# Altium project Slave_2_buttons.PrjPcb
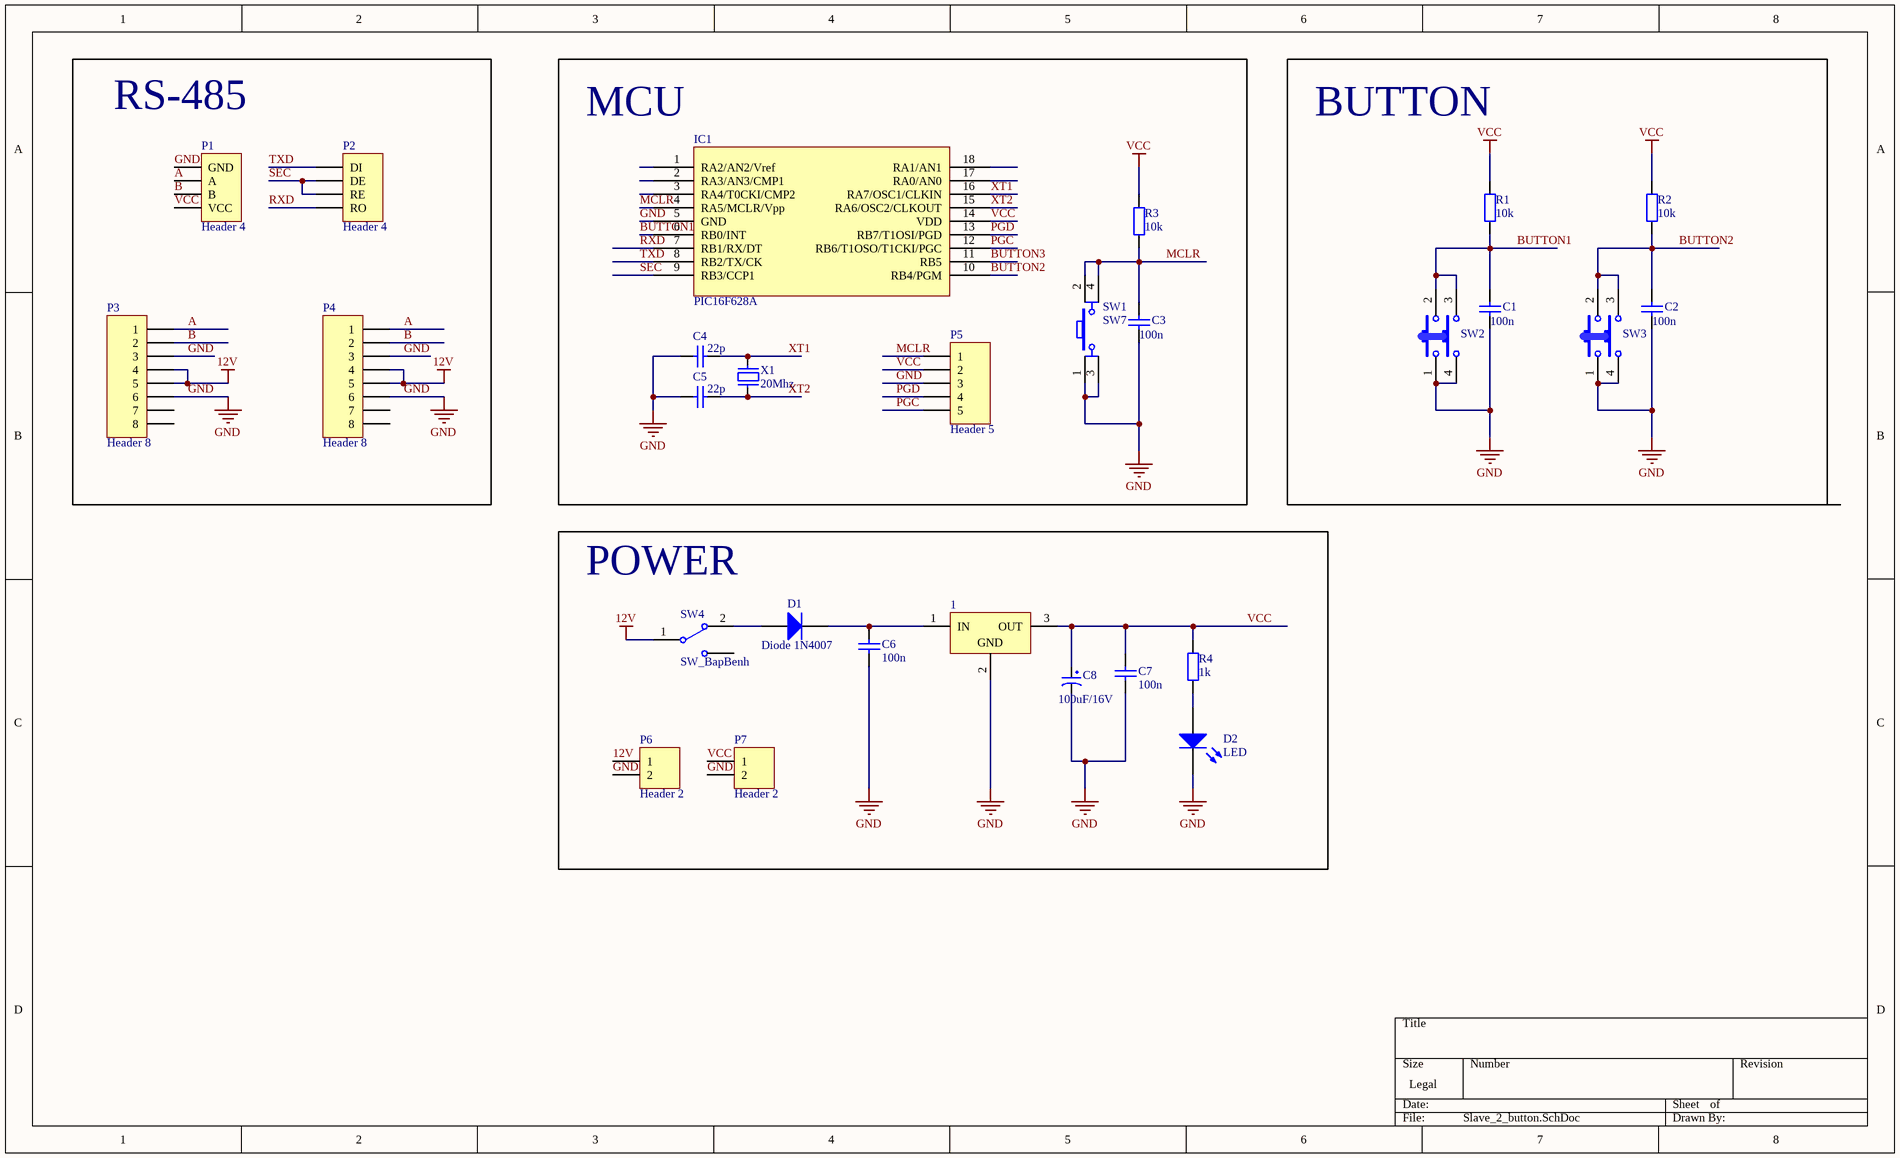
[diagram p0: Slave_2_button.SchDoc]
1 sheet, 28 parts. Net scope: global (net labels, ports and power ports of the same name join across sheets).
Board file: Slave_2_button.PcbDoc

## Sheet Slave_2_button.SchDoc
size Legal

### Parts
1  L78M05CP  [QTO-220]  (value not drawn)
C1  value 100n  [Cap Non-Pol 3mm]  (hidden comment: Capacitor Ceramic)
C2  value 100n  [Cap Non-Pol 3mm]  (hidden comment: Capacitor Ceramic)
C3  value 100n  [Cap Non-Pol 3mm]  (hidden comment: Capacitor Ceramic)
C4  value 22p  [Cap Non-Pol 3mm]  (hidden comment: Cap Non-pol)
C5  value 22p  [Cap Non-Pol 3mm]  (hidden comment: Cap Non-pol)
C6  value 100n  [Cap Non-Pol 3mm]  (hidden comment: Cap Non-pol)
C7  value 100n  [Cap Non-Pol 3mm]  (hidden comment: Cap Non-pol)
C8  100uF/16V  [CP1.5/3.4]
D1  Diode 1N4007  [DO-41]
D2  LED  [LED-5mm RED]
IC1  PIC16F628A  [DIP18/W0.3]
P1  Header 4  [HDR1X4]
P2  Header 4  [HDR1X4]
P3  Header 8  [RJ11]
P4  Header 8  [RJ11]
P5  Header 5  [Header 5]
P6  Header 2  [HDR1X2]
P7  Header 2  [HDR1X2]
R1  value 10k  [RESISTOR 1/4W]  (hidden comment: RES_SMD_0805)
R2  value 10k  [RESISTOR 1/4W]  (hidden comment: RES_SMD_0805)
R3  value 10k  [RESISTOR 1/4W]  (hidden comment: RES_SMD_0805)
R4  value 1k  [RESISTOR 1/4W]  (hidden comment: RES_SMD_0805)
SW1  SW7  [SW4]
SW2  SW-4P-B  [SW-4P-B]  (value not drawn)
SW3  SW-4P-B  [SW-4P-B]  (value not drawn)
SW4  SW_BapBenh  [SW_Bapbenh]
X1  20Mhz  [XT2]

### Blocks framed on the sheet
RS-485: P1-P4
MCU: C3-C5 IC1 P5 R3 SW1 X1
POWER: 1 C6-C8 D1 D2 P6 P7 R4 SW4

### Nets
12V: P3.4 P3.5 P4.4 P4.5 P6.1 SW4.1
GND: 1.2(GND) C1.1 C2.1 C3.1 C4.2 C5.2 C6.1 C7.1 C8.2 D2.2(K) IC1.5(GND) P1.1(GND) P3.3 P3.6 P4.3 P4.6 P5.3 P6.2 P7.2 SW1.1 SW1.3 SW2.1 SW2.4 SW3.1 SW3.4
VCC: 1.3(OUT) C7.2 C8.1 IC1.14(VDD) P1.4(VCC) P5.2 P7.1 R1.2 R2.2 R3.2 R4.2
A: P1.2(A) P3.1 P4.1
B: P1.3(B) P3.2 P4.2
BUTTON1: C1.2 IC1.6(RB0/INT) R1.1 SW2.2 SW2.3
BUTTON2: C2.2 IC1.10(RB4/PGM) R2.1 SW3.2 SW3.3
BUTTON3: IC1.11(RB5)
MCLR: C3.2 IC1.4(RA5/MCLR/Vpp) P5.1 R3.1 SW1.2 SW1.4
PGC: IC1.12(RB6/T1OSO/T1CKI/PGC) P5.5
PGD: IC1.13(RB7/T1OSI/PGD) P5.4
RXD: IC1.7(RB1/RX/DT) P2.4(RO)
SEC: IC1.9(RB3/CCP1) P2.2(DE) P2.3(RE)
TXD: IC1.8(RB2/TX/CK) P2.1(DI)
XT1: C4.1 IC1.16(RA7/OSC1/CLKIN) X1.2
XT2: C5.1 IC1.15(RA6/OSC2/CLKOUT) X1.1
Net1_1: 1.1(IN) C6.2 D1.2(K)
NetD1_1: D1.1(A) SW4.2
NetD2_1: D2.1(A) R4.1

Not connected (* = marked no-connect by the designer): IC1 1(RA2/AN2/Vref) 2(RA3/AN3/CMP1) 3(RA4/T0CKI/CMP2) 17(RA0/AN0) 18(RA1/AN1); P3 7 8; P4 7 8

### Notes on the sheet
- BUTTON

### Library data of the parts
1 = L78M05CP: Positive Voltage Regulator; Note: Tab is connected to pin 3 (GND).; Published: 24-Aug-2001; LatestRevisionDate: 17-Jul-2002; LatestRevisionNote: Re-released for DXP Platform.; DatasheetVersion: Apr-1994; PackageVersion: Jul-1998; PackageReference: ISOWATT220AB; Publisher: Altium Limited; PackageDescription: TO, Thru-Hole, Vertical, Heatsink Mounted; 3 In-Line Leads; Pitch 2.54 mm; Pin sequence 1, 3, 2; ComponentLink1Description: Manufacturer Link; ComponentLink1URL: http://www.st.com/; ComponentLink2Description: Datasheet; ComponentLink2URL: http://www.st.com/stonline/products/literature/ds/2146/l78m05c.pdf
C1-C3 = CapSMD: Capacitor; Published: 8-Jun-2000; LatestRevisionDate: 17-Jul-2002; LatestRevisionNote: Re-released for DXP Platform.; PackageReference: RAD-0.3; Publisher: Altium Limited
C4-C7 = Cap Non-pol: Non-polarized Capacitor; Published: 8-Jun-2000; LatestRevisionDate: 17-Jul-2002; LatestRevisionNote: Re-released for DXP Platform.; PackageReference: RAD-0.3; Publisher: Altium Limited
C8 = CP3: Cap 100uF/35V - 470uF/16V; Value: 100uF/35V/50V; Description 1: 1000uF/6,3V - 470uF/16V - 330uF - 25V; Description 2: 220uF/35V - 100uF/50V - 63V - 4,7uF/200V; Description 3: 22uF => 33uF100V - 3,3uF => 4,7uF/250V; Description 4: 2,2uF =>3,3uF/350 - 2,2uF/400V - 1uF/450V
D1 = Diode 1N4007: 1 Amp General Purpose Rectifier; Published: 8-Jun-2000; LatestRevisionDate: 17-Jul-2002; LatestRevisionNote: Re-released for DXP Platform.; DatasheetVersion: 1998; PackageVersion: Aug-1999; PackageReference: DO-41; Publisher: Altium Limited; PackageDescription: Diode, Axial; Body 5.2 x 2.7 mm (LxDia. max), Lead Dia. 0.86 mm (max); Code_JEDEC: DO-204-AL; ComponentLink1Description: Manufacturer Link; ComponentLink1URL: http://www.fairchildsemi.com/; ComponentLink2Description: Datasheet; ComponentLink2URL: http://www.fairchildsemi.com/ds/1N%2F1N4001.pdf
D2 = LED: Typical LED; Published: 8-Jun-2000; LatestRevisionDate: 08-Jul-2005; LatestRevisionNote: Mech Layer 1 removed.; PackageReference: LED-1; Publisher: Altium Limited
P1 P2 = Header 4: Header, 4-Pin; LatestRevisionDate: 17-Jul-2002; LatestRevisionNote: Re-released for DXP Platform.; Publisher: Altium Limited
P3 P4 = Header 8: Header, 8-Pin; LatestRevisionDate: 17-Jul-2002; LatestRevisionNote: Re-released for DXP Platform.; Publisher: Altium Limited
P5 = Header 5: Header, 5-Pin; LatestRevisionDate: 17-Jul-2002; LatestRevisionNote: Re-released for DXP Platform.; Publisher: Altium Limited
P6 P7 = Header 2: Header, 2-Pin; LatestRevisionDate: 17-Jul-2002; LatestRevisionNote: Re-released for DXP Platform.; Publisher: Altium Limited
R1-R4 = RES_SMD_0805: RES_0805; Published: 8-Jun-2000; LatestRevisionDate: 17-Jul-2002; LatestRevisionNote: Re-released for DXP Platform.; PackageReference: AXIAL-0.4; Publisher: Altium Limited
SW1 = SW4: Switch button 4 pin; Value: Button chip 4 pin
SW2 SW3 = SW-4PIN-BIG: Switch Big 4 Pin; Published: 24-Mar-1999; LatestRevisionDate: 17-Jul-2002; LatestRevisionNote: Re-released for DXP Platform.; PackageReference: SPST-2; Publisher: Altium Limited
X1 = XT2: Crystal For all Crystal 2pin.; Value: 4Mhz